# Altium schematic sheet Gate_Drivers.SchDoc
size A3; SheetNumber: 9; SheetTotal: 16
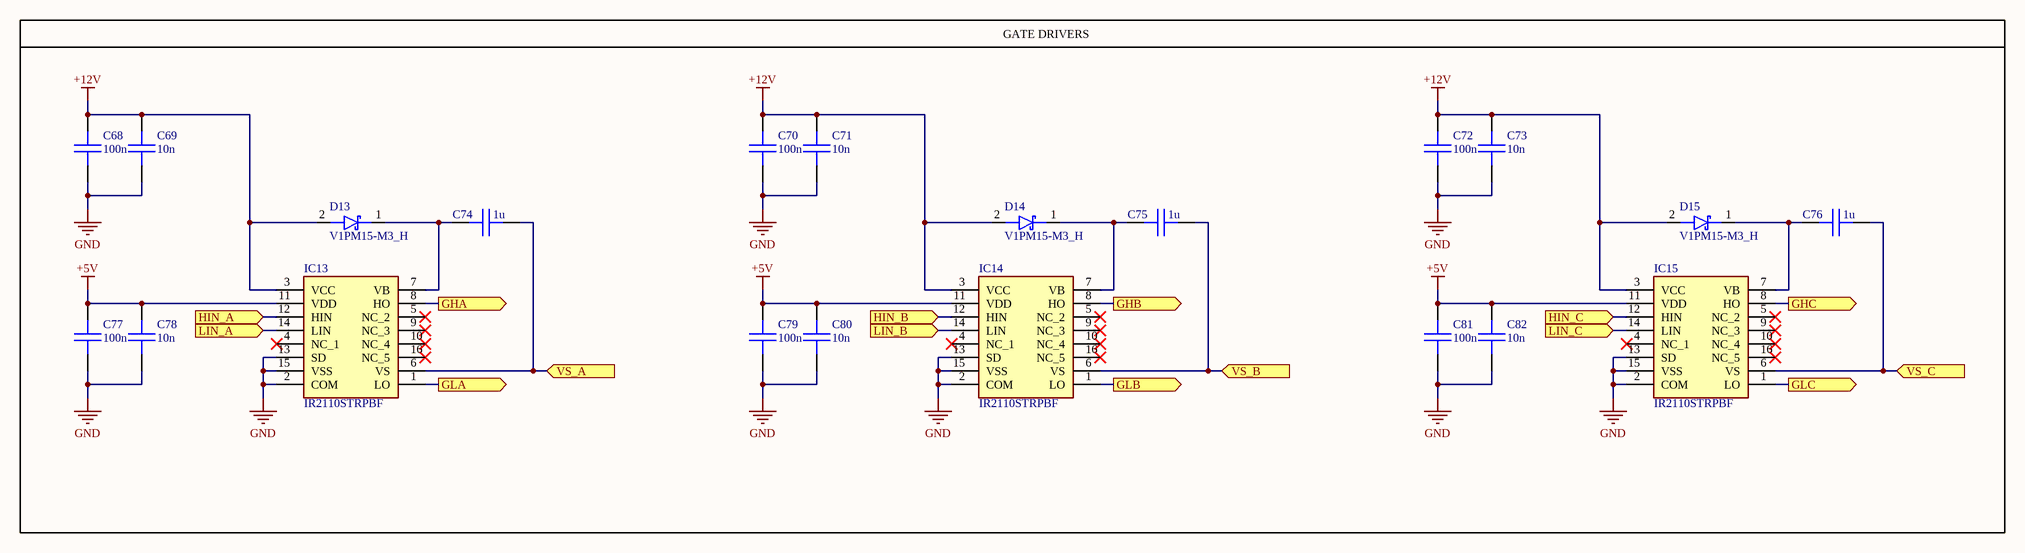
[diagram p0: Gate_Drivers.SchDoc]

## Parts
C68  100n  [C_0603]
C69  10n  [C_0603]
C70  100n  [C_0603]
C71  10n  [C_0603]
C72  100n  [C_0603]
C73  10n  [C_0603]
C74  1u  [C_0805]
C75  1u  [C_0805]
C76  1u  [C_0805]
C77  100n  [C_0603]
C78  10n  [C_0603]
C79  100n  [C_0603]
C80  10n  [C_0603]
C81  100n  [C_0603]
C82  10n  [C_0603]
D13  V1PM15-M3_H  [DO-219AD-2]
D14  V1PM15-M3_H  [DO-219AD-2]
D15  V1PM15-M3_H  [DO-219AD-2]
IC13  IR2110STRPBF  [SOIC127P1032X265-16N]
IC14  IR2110STRPBF  [SOIC127P1032X265-16N]
IC15  IR2110STRPBF  [SOIC127P1032X265-16N]

## Blocks framed on the sheet
GATE DRIVERS: C68-C82 D13-D15 IC13-IC15

## Ports
GHA (out, see Interconnections[2C], Headers[1B]), GHB (out, see Interconnections[2C], Headers[1B]), GHC (out, see Interconnections[2C], Headers[2B]), GLA (out, see Interconnections[2C], Headers[1B]), GLB (out, see Interconnections[2C], Headers[2B]), GLC (out, see Interconnections[2C], Headers[2B]), HIN_A (in, see Interconnections[3C], Isolator_Gate_Driver[2A]), HIN_B (in, see Interconnections[3C], Isolator_Gate_Driver[2A]), HIN_C (in, see Interconnections[3C], Isolator_Gate_Driver[2A]), LIN_A (in, see Interconnections[3C], Isolator_Gate_Driver[2A]), LIN_B (in, see Interconnections[3C], Isolator_Gate_Driver[2A]), LIN_C (in, see Interconnections[3C], Isolator_Gate_Driver[2A]), VS_A (in, see Interconnections[2C], Headers[1C]), VS_B (in, see Interconnections[2C], Headers[1C]), VS_C (in, see Interconnections[2C], Headers[1C])

## Nets
+5V: C77.2 C78.2 C79.2 C80.2 C81.2 C82.2 IC13.11(VDD) IC14.11(VDD) IC15.11(VDD)
+12V: C68.2 C69.2 C70.2 C71.2 C72.2 C73.2 D13.2(A) D14.2(A) D15.2(A) IC13.3(VCC) IC14.3(VCC) IC15.3(VCC)
GND: C68.1 C69.1 C70.1 C71.1 C72.1 C73.1 C77.1 C78.1 C79.1 C80.1 C81.1 C82.1 IC13.2(COM) IC13.13(SD) IC13.15(VSS) IC14.2(COM) IC14.13(SD) IC14.15(VSS) IC15.2(COM) IC15.13(SD) IC15.15(VSS)
GHA: IC13.8(HO) ; port GHA
GHB: IC14.8(HO) ; port GHB
GHC: IC15.8(HO) ; port GHC
GLA: IC13.1(LO) ; port GLA
GLB: IC14.1(LO) ; port GLB
GLC: IC15.1(LO) ; port GLC
HIN_A: IC13.12(HIN) ; port HIN_A
HIN_B: IC14.12(HIN) ; port HIN_B
HIN_C: IC15.12(HIN) ; port HIN_C
LIN_A: IC13.14(LIN) ; port LIN_A
LIN_B: IC14.14(LIN) ; port LIN_B
LIN_C: IC15.14(LIN) ; port LIN_C
VS_A: C74.1 IC13.6(VS) ; port VS_A
VS_B: C75.1 IC14.6(VS) ; port VS_B
VS_C: C76.1 IC15.6(VS) ; port VS_C
NetC74_2: C74.2 D13.1(K) IC13.7(VB)
NetC75_2: C75.2 D14.1(K) IC14.7(VB)
NetC76_2: C76.2 D15.1(K) IC15.7(VB)

Not connected (* = marked no-connect by the designer): IC13 4(NC_1)* 5(NC_2)* 9(NC_3)* 10(NC_4)* 16(NC_5)*; IC14 4(NC_1)* 5(NC_2)* 9(NC_3)* 10(NC_4)* 16(NC_5)*; IC15 4(NC_1)* 5(NC_2)* 9(NC_3)* 10(NC_4)* 16(NC_5)*

## Library data of the parts
C68-C82 = CAP: SMD Chip Capacitor
D13-D15 = DIODE_SCHOTTKY_V1PM15-M3_H: Schottky Diode, 150V, 1A, Vf: 1.13V; Vf: 1.3V; ComponentLink1Description: New link; ComponentLink1URL: https://www.mouser.com.tr/ProductDetail/Vishay-General-Semiconductor/V1PM15-M3-H?qs=%252BdQmOuGyFcHNPmRG94B76g%3D%3D; Vrm: 150V; If: 1A
IC13-IC15 = IR2110STRPBF: Integrated Circuit; Manufacturer_Name: Infineon; Datasheet Link: https://www.infineon.com/cms/en/product/power/gate-driver-ics/?; Height: 2.65mm; Manufacturer_Part_Number: IR2110STRPBF; Mouser Part Number: 942-IR2110STRPBF; Mouser Price/Stock: https://www.mouser.co.uk/ProductDetail/Infineon-Technologies/IR2110STRPBF?qs=2r01AXMCG3P4pNuJUqFzxg%3D%3D; Arrow Part Number: IR2110STRPBF; Arrow Price/Stock: https://www.arrow.com/en/products/ir2110strpbf/infineon-technologies-ag?utm_currency=USD&region=nac